# Altium schematic sheet HYDRA_V3_TEMPLATE.SchDoc
size B; SheetNumber: 1; SheetTotal: 3
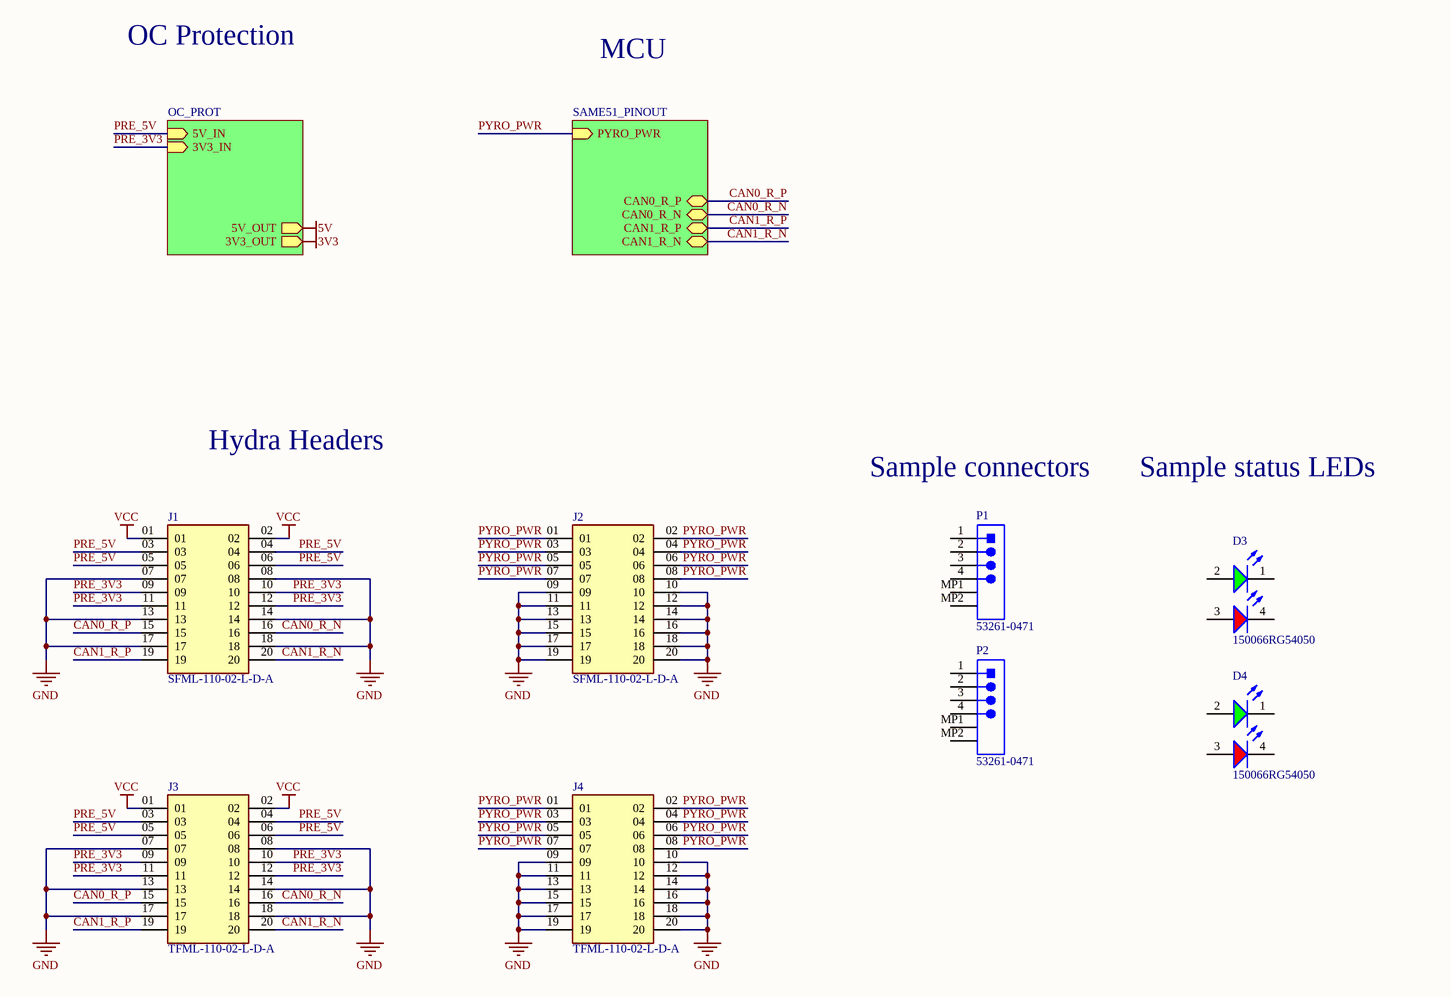
[diagram p0: HYDRA_V3_TEMPLATE.SchDoc]

## Parts
D3  150066RG54050  [WL-SBCD_0606]
D4  150066RG54050  [WL-SBCD_0606]
J1  SFML-110-02-L-D-A  [SFML-110-02-L-D-A-Footprint-1]
J2  SFML-110-02-L-D-A  [SFML-110-02-L-D-A-Footprint-1]
J3  TFML-110-02-L-D-A  [TFML-110-02-L-D-A-Footprint-1]
J4  TFML-110-02-L-D-A  [TFML-110-02-L-D-A-Footprint-1]
P1  53261-0471  [MOLEX-53261-0471_V]
P2  53261-0471  [MOLEX-53261-0471_V]

## Sub-sheets
MCU_PINOUT = SAME51_PINOUT: CAN0_R_P (bidir), CAN0_R_N (bidir), PYRO_PWR (in), CAN1_R_P (bidir), CAN1_R_N (bidir)
OC_PROT = OC_PROT: 5V_OUT (out), 5V_IN (in), 3V3_IN (in), 3V3_OUT (out)

## Nets
3V3: sheet OC_PROT/3V3_OUT
5V: sheet OC_PROT/5V_OUT
GND: J1.07 J1.08 J1.13 J1.14 J1.17 J1.18 J2.09 J2.10 J2.11 J2.12 J2.13 J2.14 J2.15 J2.16 J2.17 J2.18 J2.19 J2.20 J3.07 J3.08 J3.13 J3.14 J3.17 J3.18 J4.09 J4.10 J4.11 J4.12 J4.13 J4.14 J4.15 J4.16 J4.17 J4.18 J4.19 J4.20
VCC: J1.01 J1.02 J3.01 J3.02
CAN0_R_N: J1.16 J3.16 ; sheet MCU_PINOUT/CAN0_R_N
CAN0_R_P: J1.15 J3.15 ; sheet MCU_PINOUT/CAN0_R_P
CAN1_R_N: J1.20 J3.20 ; sheet MCU_PINOUT/CAN1_R_N
CAN1_R_P: J1.19 J3.19 ; sheet MCU_PINOUT/CAN1_R_P
PRE_3V3: J1.09 J1.10 J1.11 J1.12 J3.09 J3.10 J3.11 J3.12 ; sheet OC_PROT/3V3_IN
PRE_5V: J1.03 J1.04 J1.05 J1.06 J3.03 J3.04 J3.05 J3.06 ; sheet OC_PROT/5V_IN
PYRO_PWR: J2.01 J2.02 J2.03 J2.04 J2.05 J2.06 J2.07 J2.08 J4.01 J4.02 J4.03 J4.04 J4.05 J4.06 J4.07 J4.08 ; sheet MCU_PINOUT/PYRO_PWR

Not connected (* = marked no-connect by the designer): D3 1(K) 2(A) 3(A) 4(K); D4 1(K) 2(A) 3(A) 4(K); P1 1 2 3 4 MP1 MP2; P2 1 2 3 4 MP1 MP2

## Notes on the sheet
- OC Protection
- MCU
- Hydra Headers
- Sample connectors
- Sample status LEDs

## Library data of the parts
D3 D4 = CMP-004-00034-2: Led, Red/Grn, 180Mcd/230Mcd, 624Nm/525Nm Rohs Compliant: Yes
J1 J2 = CMP-002-00076-2: Headers & Wire Housings .050 Tiger Eye High-Reliability Locking Socket Strip
J3 J4 = CMP-002-00077-1: Conn Shrouded Header (4 Sides) HDR 20 POS 1.27mm Solder ST Top Entry SMD TIGER EYE™ Tube
P1 P2 = CMP-2000-05238-1: Male Header, Pitch 1.25 mm, 1 x 4 Position, Height 3.4 mm, -40 to 85 degC, RoHS, Tape and Reel; Current Rating: 1A; Brand: Molex; Number of Positions / Contacts: 4; Pitch: 1.25mm; Voltage Rating: 125V; Mounting Angle: Right; Manufacturer URL: http://www.molex.com/; Factory Pack Quantity: 1000; Housing Material: Thermoplastic; Datasheet URL: http://www.molex.com/pdm_docs/sd/532610471_sd.pdf; Tradename: PicoBlade; Product Type: Headers; Contact Plating: Tin; Contact Material: PhosphorBronze; Package Description: 1.25mm Pitch PicoBlade(TM) Header, Surface Mount, Right Angle, Lead-Free, 4 Circuits; Mounting Style: SMD/SMT; Manufacturer: Molex; Series: 53261; Packaging: Reel; Number of Rows: 1; RoHS: Details; Number of Positions: 4; Product Category: Headers&WireHousings; Datasheet Version: Rev. G, 01/2012; Type: Shrouded; Termination Style: SMD